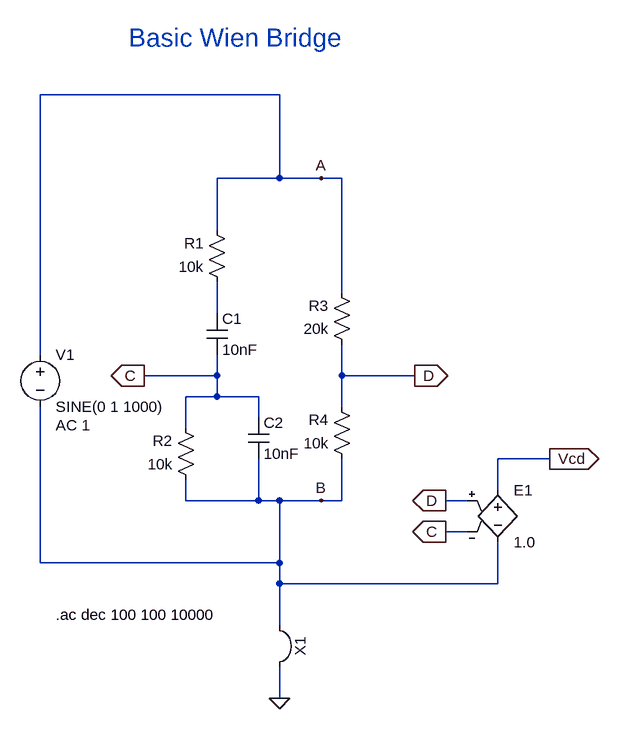
[diagram p0: schematic basic_wien_bridge.asc]
basic_wien_bridge.asc, the LTspice schematic file:
Version 4
SHEET 1 1136 792
WIRE 144 -160 -224 -160
WIRE 144 -32 144 -160
WIRE 144 -32 48 -32
WIRE 208 -32 144 -32
WIRE 240 -32 208 -32
WIRE 48 48 48 -32
WIRE 240 144 240 -32
WIRE 48 176 48 128
WIRE -224 240 -224 -160
WIRE 48 272 48 240
WIRE 48 272 -64 272
WIRE 240 272 240 224
WIRE 352 272 240 272
WIRE 48 304 48 272
WIRE 48 304 0 304
WIRE 112 304 48 304
WIRE 240 320 240 272
WIRE 112 336 112 304
WIRE 0 352 0 304
WIRE 560 400 480 400
WIRE 480 448 480 400
WIRE 0 464 0 432
WIRE 112 464 112 400
WIRE 112 464 0 464
WIRE 144 464 112 464
WIRE 208 464 144 464
WIRE 240 464 240 400
WIRE 240 464 208 464
WIRE 432 464 400 464
WIRE 432 512 400 512
WIRE -224 560 -224 320
WIRE 144 560 144 464
WIRE 144 560 -224 560
WIRE 144 592 144 560
WIRE 480 592 480 528
WIRE 480 592 144 592
WIRE 144 656 144 592
WIRE 144 768 144 720
FLAG 144 768 0
FLAG -64 272 C
IOPIN -64 272 Out
FLAG 352 272 D
IOPIN 352 272 Out
FLAG 208 -32 A
FLAG 208 464 B
FLAG 560 400 Vcd
IOPIN 560 400 Out
FLAG 400 464 D
IOPIN 400 464 Out
FLAG 400 512 C
IOPIN 400 512 Out
SYMBOL res 64 144 R180
WINDOW 0 36 76 Left 2
WINDOW 3 36 40 Left 2
SYMATTR InstName R1
SYMATTR Value 10k
SYMBOL res 16 448 R180
WINDOW 0 36 76 Left 2
WINDOW 3 36 40 Left 2
SYMATTR InstName R2
SYMATTR Value 10k
SYMBOL res 256 240 R180
WINDOW 0 36 76 Left 2
WINDOW 3 36 40 Left 2
SYMATTR InstName R3
SYMATTR Value 20k
SYMBOL res 256 416 R180
WINDOW 0 36 76 Left 2
WINDOW 3 36 40 Left 2
SYMATTR InstName R4
SYMATTR Value 10k
SYMBOL Misc\\jumper 208 688 R90
SYMATTR InstName X1
SYMBOL voltage -224 224 R0
WINDOW 123 24 124 Left 2
WINDOW 39 0 0 Left 0
SYMATTR InstName V1
SYMATTR Value SINE(0 1 1000)
SYMATTR Value2 AC 1
SYMBOL e 480 432 R0
SYMATTR InstName E1
SYMATTR Value 1.0
SYMBOL cap 32 176 R0
SYMATTR InstName C1
SYMATTR Value 10nF
SYMBOL cap 96 336 R0
SYMATTR InstName C2
SYMATTR Value 10nF
TEXT -200 640 Left 2 !.ac dec 100 100 10000
TEXT -88 -248 Left 4 ;Basic Wien Bridge

The netlist it stands for:
* basic_wien_bridge.asc
R1 N001 A 10k
R2 0 C 10k
R3 D A 20k
R4 0 D 10k
V1 A 0 SINE(0 1 1000) AC 1
E1 Vcd 0 D C 1.0
C1 N001 C 10nF
C2 C 0 10nF
.ac dec 100 100 10000
* Basic Wien Bridge
.backanno
.end